# EAGLE design Lepton (EAGLE 6.4)

## Sheet 1 of 5
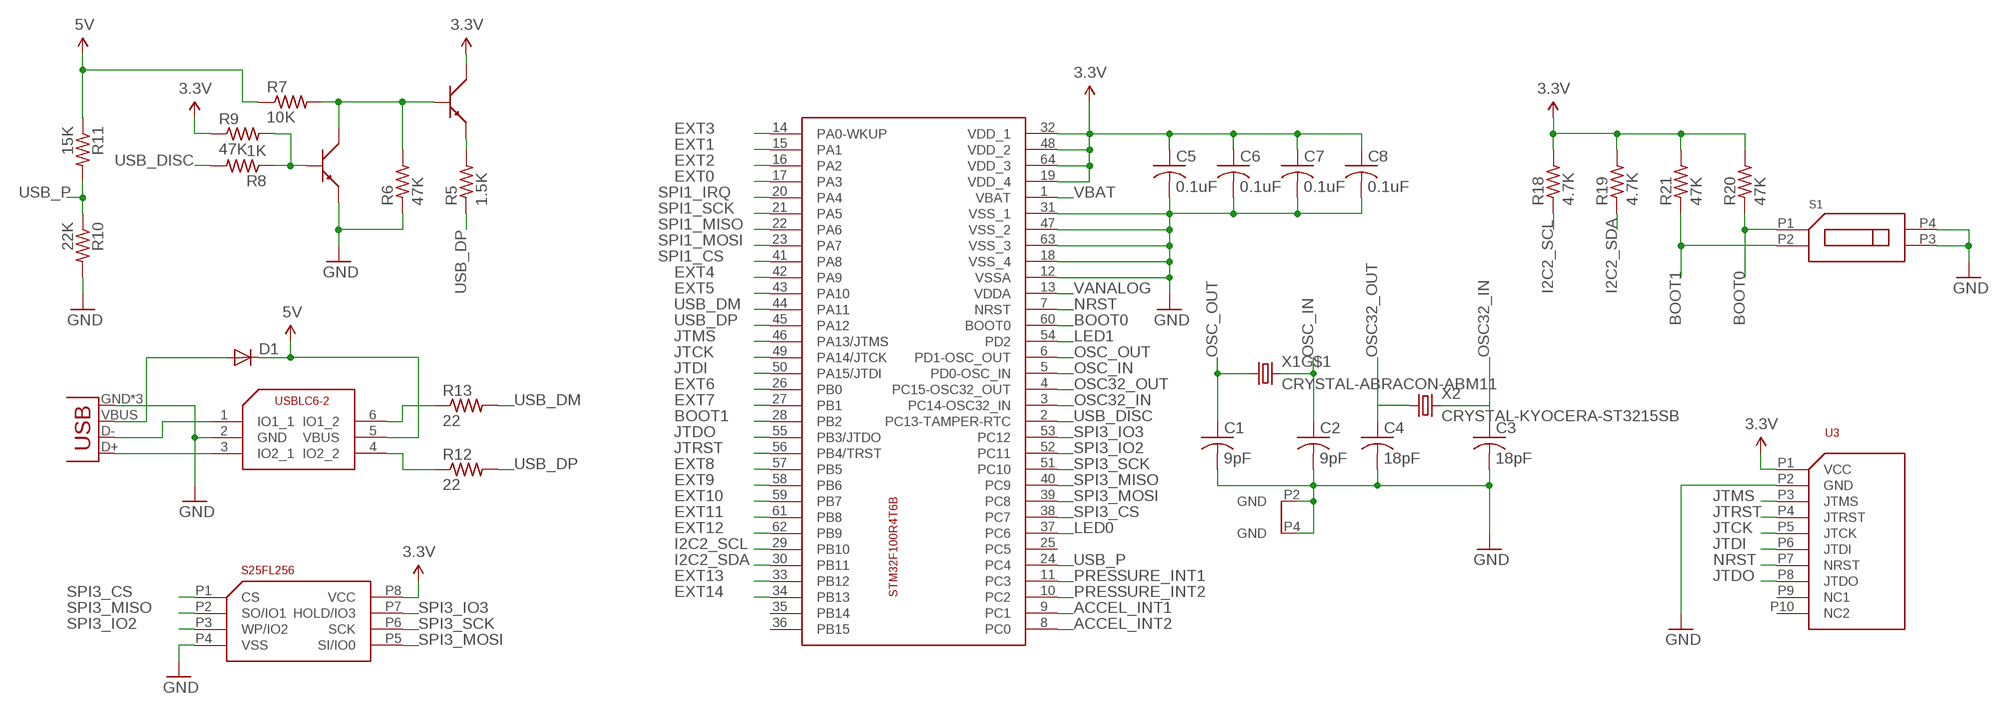
[diagram p0: schematic, sheet 1]

### Parts
C1  9pF  C-USC0201  [C0201]
C2  9pF  C-USC0201  [C0201]
C3  18pF  C-USC0201  [C0201]
C4  18pF  C-USC0201  [C0201]
C5  0.1uF  C-USC0201  [C0201]
C6  0.1uF  C-USC0201  [C0201]
C7  0.1uF  C-USC0201  [C0201]
C8  0.1uF  C-USC0201  [C0201]
D1  DIODE-MINIMELF  [MINIMELF]
JP1  USB-MICROB  [USB-MICROB]
R5  1.5K  R-US_R0402  [R0402]
R6  47K  R-US_R0402  [R0402]
R7  10K  R-US_R0201  [R0201]
R8  1K  R-US_R0201  [R0201]
R9  47K  R-US_R0201  [R0201]
R10  22K  R-US_R0201  [R0201]
R11  15K  R-US_R0201  [R0201]
R12  22  R-US_R0201  [R0201]
R13  22  R-US_R0201  [R0201]
R18  4.7K  R-US_R0201  [R0201]
R19  4.7K  R-US_R0201  [R0201]
R20  47K  R-US_R0201  [R0201]
R21  47K  R-US_R0201  [R0201]
S1  SWITCH-DIP-GDH-02  [SWITCH-DIP-GDH-02]
U2  STM32F100R4T6B  [S-PQFP64-G64]
U3  STM32-JTAG-FFC  [FCI-FFC-10P-51281-1494]
U$1  SPANSION-S25FL256  [SPANSION-WSON-8]
U$2  BIPOLAR-PMBT6428  [DUBLIB_SOT23]
U$3  BIPOLAR-PMBT6428  [DUBLIB_SOT23]
U$4  USBLC6-2  [SOT23-6L]
X1  CRYSTAL-ABRACON-ABM11  [ABM11]
X2  CRYSTAL-KYOCERA-ST3215SB  [CRYSTAL-KYOCERA-ST3215SB]

### Nets
3.3V: C5.1 C6.1 C7.1 C8.1 R9.1 R18.2 R19.2 R20.2 R21.2 U2.19(VDD_4) U2.32(VDD_1) U2.48(VDD_2) U2.64(VDD_3) U3.P1(VCC) U$1.P8(VCC) U$2.3 ; supply symbol labelled @3.3V ; also sheet 3,4,5
5V: D1.C R7.1 R11.1 U$4.5(VBUS) ; supply symbol labelled @5V ; also sheet 2,4
ACCEL_INT1: U2.9(PC1)
ACCEL_INT2: U2.8(PC0) ; also sheet 5
BOOT0: R20.1 S1.P1(SW0_0) U2.60(BOOT0)
BOOT1: R21.1 S1.P2(SW1_0) U2.28(PB2)
EXT0: U2.17(PA3) ; also sheet 2
EXT1: U2.15(PA1) ; also sheet 2
EXT2: U2.16(PA2) ; also sheet 2
EXT3: U2.14(PA0-WKUP) ; also sheet 2
EXT4: U2.42(PA9) ; also sheet 2
EXT5: U2.43(PA10) ; also sheet 2
EXT6: U2.26(PB0) ; also sheet 2
EXT7: U2.27(PB1) ; also sheet 2
EXT8: U2.57(PB5) ; also sheet 2
EXT9: U2.58(PB6) ; also sheet 2
EXT10: U2.59(PB7) ; also sheet 2
EXT11: U2.61(PB8) ; also sheet 2
EXT12: U2.62(PB9) ; also sheet 2
EXT13: U2.33(PB12) ; also sheet 2
EXT14: U2.34(PB13) ; also sheet 2
GND: C1.2 C2.2 C3.2 C4.2 C5.2 C6.2 C7.2 C8.2 JP1.GND JP1.MT1(GND) JP1.MT2(GND) R6.1 R10.2 S1.P3(SW1_1) S1.P4(SW0_1) U2.12(VSSA) U2.18(VSS_4) U2.31(VSS_1) U2.47(VSS_2) U2.63(VSS_3) U3.P2(GND) U$1.P4(VSS) U$3.2 U$4.2(GND) X1.P2(GND) X1.P4(GND) ; supply symbol labelled @GND ; also sheet 2,3,4,5
I2C2_SCL: R18.1 U2.29(PB10) ; also sheet 5
I2C2_SDA: R19.1 U2.30(PB11) ; also sheet 5
JTCK: U2.49(PA14/JTCK) U3.P5(JTCK)
JTDI: U2.50(PA15/JTDI) U3.P6(JTDI)
JTDO: U2.55(PB3/JTDO) U3.P8(JTDO)
JTMS: U2.46(PA13/JTMS) U3.P3(JTMS)
JTRST: U2.56(PB4/TRST) U3.P4(JTRST)
LED0: U2.37(PC6) ; also sheet 2
LED1: U2.54(PD2) ; also sheet 2
N$1: JP1.D+ U$4.3(IO2_1)
N$2: JP1.D- U$4.1(IO1_1)
N$9: D1.A JP1.VBUS
N$14: R13.1 U$4.6(IO1_2)
N$15: R5.2 U$2.2
N$16: R6.2 R7.2 U$2.1 U$3.3
N$17: R8.1 R9.2 U$3.1
N$19: R12.1 U$4.4(IO2_2)
NRST: U2.7(NRST) U3.P7(NRST)
OSC32_IN: C3.1 U2.3(PC14-OSC32_IN) X2.P2
OSC32_OUT: C4.1 U2.4(PC15-OSC32_OUT) X2.P1
OSC_IN: C2.1 U2.5(PD0-OSC_IN) X1.P3
OSC_OUT: C1.1 U2.6(PD1-OSC_OUT) X1.P1
PRESSURE_INT1: U2.11(PC3) ; also sheet 5
PRESSURE_INT2: U2.10(PC2) ; also sheet 5
SPI1_CS: U2.41(PA8) ; also sheet 3
SPI1_IRQ: U2.20(PA4) ; also sheet 3
SPI1_MISO: U2.22(PA6) ; also sheet 3
SPI1_MOSI: U2.23(PA7) ; also sheet 3
SPI1_SCK: U2.21(PA5) ; also sheet 3
SPI3_CS: U2.38(PC7) U$1.P1(CS)
SPI3_IO2: U2.52(PC11) U$1.P3(WP/IO2)
SPI3_IO3: U2.53(PC12) U$1.P7(HOLD/IO3)
SPI3_MISO: U2.40(PC9) U$1.P2(SO/IO1)
SPI3_MOSI: U2.39(PC8) U$1.P5(SI/IO0)
SPI3_SCK: U2.51(PC10) U$1.P6(SCK)
USB_DISC: R8.2 U2.2(PC13-TAMPER-RTC) ; also sheet 2
USB_DM: R13.2 U2.44(PA11) ; also sheet 2
USB_DP: R5.1 R12.2 U2.45(PA12) ; also sheet 2
USB_P: R10.1 R11.2 U2.24(PC4)
VANALOG: U2.13(VDDA) ; also sheet 4
VBAT: U2.1(VBAT) ; also sheet 4
Unconnected: U2.25(PC5) U2.35(PB14) U2.36(PB15) U3.P9(NC1) U3.P10(NC2)

## Sheet 2 of 5
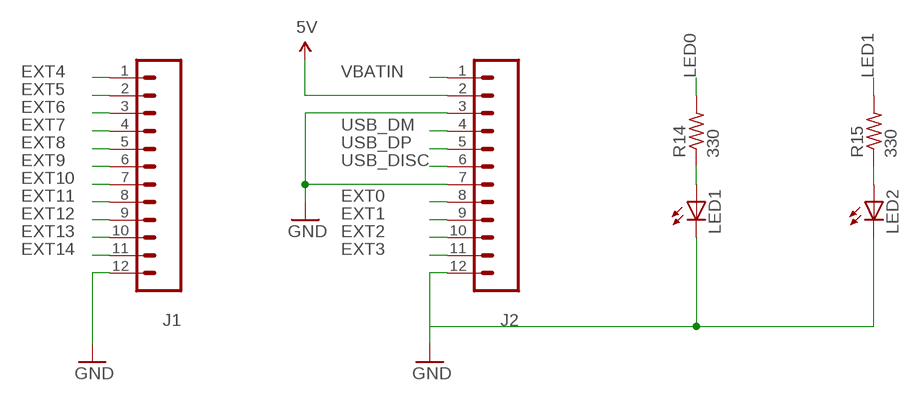
[diagram p1: schematic, sheet 2]

### Parts
J1  M12  [1X12]
J2  M12  [1X12]
LED1  LED0603  [LED-0603]
LED2  LED0603  [LED-0603]
R14  330  R-US_R0201  [R0201]
R15  330  R-US_R0201  [R0201]

### Nets
5V: J2.2 ; supply symbol labelled @5V ; also sheet 1,4
EXT0: J2.8 ; also sheet 1
EXT1: J2.9 ; also sheet 1
EXT2: J2.10 ; also sheet 1
EXT3: J2.11 ; also sheet 1
EXT4: J1.1 ; also sheet 1
EXT5: J1.2 ; also sheet 1
EXT6: J1.3 ; also sheet 1
EXT7: J1.4 ; also sheet 1
EXT8: J1.5 ; also sheet 1
EXT9: J1.6 ; also sheet 1
EXT10: J1.7 ; also sheet 1
EXT11: J1.8 ; also sheet 1
EXT12: J1.9 ; also sheet 1
EXT13: J1.10 ; also sheet 1
EXT14: J1.11 ; also sheet 1
GND: J1.12 J2.3 J2.7 J2.12 LED1.C LED2.C ; supply symbol labelled @GND ; also sheet 1,3,4,5
LED0: R14.2 ; also sheet 1
LED1: R15.2 ; also sheet 1
N$24: LED1.A R14.1
N$27: LED2.A R15.1
USB_DISC: J2.6 ; also sheet 1
USB_DM: J2.4 ; also sheet 1
USB_DP: J2.5 ; also sheet 1
VBATIN: J2.1 ; also sheet 4

## Sheet 3 of 5
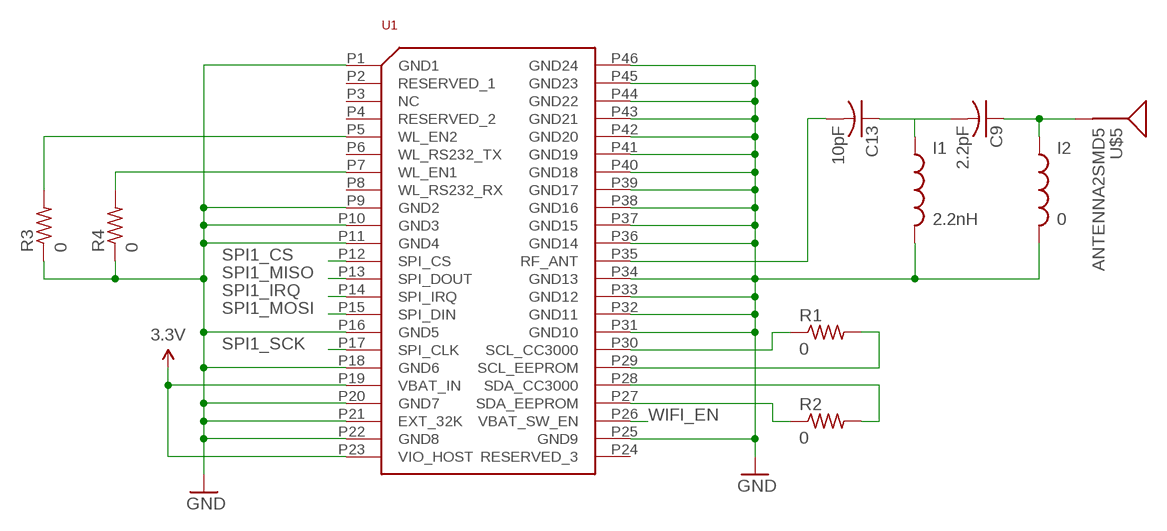
[diagram p2: schematic, sheet 3]

### Parts
C9  2.2pF  C-USC0201  [C0201]
C13  10pF  C-USC0201  [C0201]
I1  2.2nH  INDUCTOR0402  [C0402]
I2  0  INDUCTOR0402  [C0402]
R1  0  R-US_R0201  [R0201]
R2  0  R-US_R0201  [R0201]
R3  0  R-US_R0201  [R0201]
R4  0  R-US_R0201  [R0201]
U1  CC3000  [CC3000]
U$5  ANTENNA2SMD5  [ANTENNA-CHIP5]

### Nets
3.3V: U1.P19(VBAT_IN) U1.P23(VIO_HOST) ; supply symbol labelled @3.3V ; also sheet 1,4,5
ANT: C13.2 U1.P35(RF_ANT)
GND: I1.2 I2.2 R3.1 R4.1 U1.P1(GND1) U1.P9(GND2) U1.P10(GND3) U1.P11(GND4) U1.P16(GND5) U1.P18(GND6) U1.P20(GND7) U1.P21(EXT_32K) U1.P22(GND8) U1.P25(GND9) U1.P31(GND10) U1.P32(GND11) U1.P33(GND12) U1.P34(GND13) U1.P36(GND14) U1.P37(GND15) U1.P38(GND16) U1.P39(GND17) U1.P40(GND18) U1.P41(GND19) U1.P42(GND20) U1.P43(GND21) U1.P44(GND22) U1.P45(GND23) U1.P46(GND24) ; supply symbol labelled @GND ; also sheet 1,2,4,5
N$3: C9.2 C13.1 I1.1
N$10: R3.2 U1.P5(WL_EN2)
N$21: R4.2 U1.P7(WL_EN1)
N$22: C9.1 I2.1 U$5.FEED(SIGNAL)
N$23: R1.1 U1.P30(SCL_CC3000)
N$47: R1.2 U1.P29(SCL_EEPROM)
N$50: R2.2 U1.P28(SDA_CC3000)
N$51: R2.1 U1.P27(SDA_EEPROM)
SPI1_CS: U1.P12(SPI_CS) ; also sheet 1
SPI1_IRQ: U1.P14(SPI_IRQ) ; also sheet 1
SPI1_MISO: U1.P13(SPI_DOUT) ; also sheet 1
SPI1_MOSI: U1.P15(SPI_DIN) ; also sheet 1
SPI1_SCK: U1.P17(SPI_CLK) ; also sheet 1
WIFI_EN: U1.P26(VBAT_SW_EN)
Unconnected: U1.P2(RESERVED_1) U1.P3(NC) U1.P4(RESERVED_2) U1.P6(WL_RS232_TX) U1.P8(WL_RS232_RX) U1.P24(RESERVED_3)

## Sheet 4 of 5
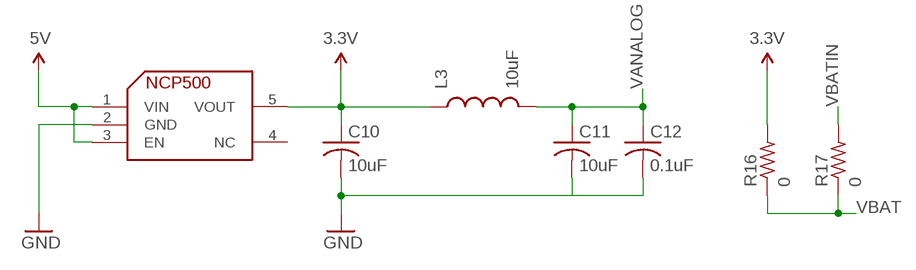
[diagram p3: schematic, sheet 4]

### Parts
C10  10uF  C-USC0603  [C0603]
C11  10uF  C-USC0603  [C0603]
C12  0.1uF  C-USC0201  [C0201]
L3  10uF  INDUCTOR0603  [0603]
R16  0  R-US_R0402  [R0402]
R17  0  R-US_R0402  [R0402]
U$7  NCP500  [SOT23-5L]

### Nets
3.3V: C10.1 L3.1 R16.2 U$7.5(VOUT) ; supply symbol labelled @3.3V ; also sheet 1,3,5
5V: U$7.1(VIN) U$7.3(EN) ; supply symbol labelled @5V ; also sheet 1,2
GND: C10.2 C11.2 C12.2 U$7.2(GND) ; supply symbol labelled @GND ; also sheet 1,2,3,5
VANALOG: C11.1 C12.1 L3.2 ; also sheet 1
VBAT: R16.1 R17.1 ; also sheet 1
VBATIN: R17.2 ; also sheet 2
Unconnected: U$7.4(NC)

## Sheet 5 of 5
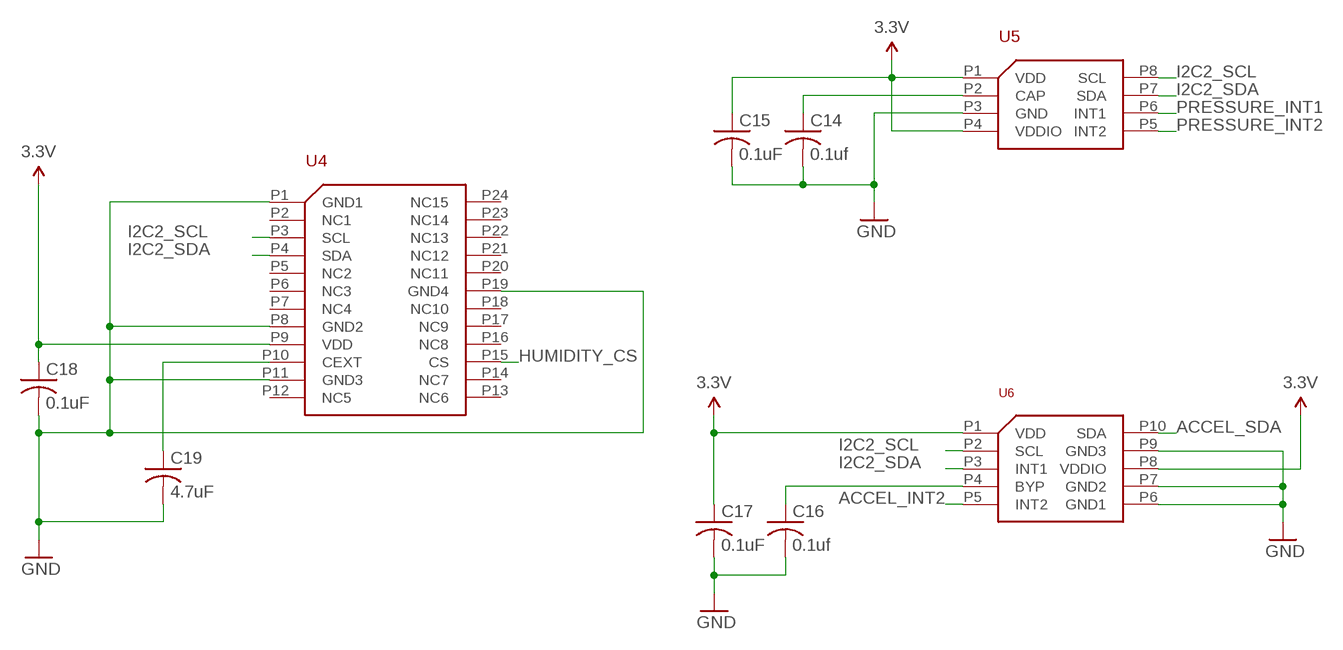
[diagram p4: schematic, sheet 5]

### Parts
C14  0.1uf  C-USC0201  [C0201]
C15  0.1uF  C-USC0201  [C0201]
C16  0.1uf  C-USC0201  [C0201]
C17  0.1uF  C-USC0201  [C0201]
C18  0.1uF  C-USC0201  [C0201]
C19  4.7uF  C-USC0402  [C0402]
U4  SILICONLABS-HUMIDITY-SI7005  [SILICONLABS-TQFN-24]
U5  FREESCALE-PRESSURE-MPL3115A2  [UQFN-8L]
U6  MMA8653FC  [DFN-2X2-10]

### Nets
3.3V: C15.1 C17.1 C18.1 U4.P9(VDD) U5.P1(VDD) U5.P4(VDDIO) U6.P1(VDD) U6.P8(VDDIO) ; supply symbol labelled @3.3V ; also sheet 1,3,4
ACCEL_INT2: U6.P5(INT2) ; also sheet 1
ACCEL_SDA: U6.P10(SDA)
GND: C14.2 C15.2 C16.2 C17.2 C18.2 C19.2 U4.P1(GND1) U4.P8(GND2) U4.P11(GND3) U4.P19(GND4) U5.P3(GND) U6.P6(GND1) U6.P7(GND2) U6.P9(GND3) ; supply symbol labelled @GND ; also sheet 1,2,3,4
HUMIDITY_CS: U4.P15(CS)
I2C2_SCL: U4.P3(SCL) U5.P8(SCL) U6.P2(SCL) ; also sheet 1
I2C2_SDA: U4.P4(SDA) U5.P7(SDA) U6.P3(INT1) ; also sheet 1
N$4: C16.1 U6.P4(BYP)
N$11: C19.1 U4.P10(CEXT)
N$12: C14.1 U5.P2(CAP)
PRESSURE_INT1: U5.P6(INT1) ; also sheet 1
PRESSURE_INT2: U5.P5(INT2) ; also sheet 1
Unconnected: U4.P2(NC1) U4.P5(NC2) U4.P6(NC3) U4.P7(NC4) U4.P12(NC5) U4.P13(NC6) U4.P14(NC7) U4.P16(NC8) U4.P17(NC9) U4.P18(NC10) U4.P20(NC11) U4.P21(NC12) U4.P22(NC13) U4.P23(NC14) U4.P24(NC15)

## Library data of the parts
C1-C19 = rcl:C-US: CAPACITOR, American symbol
D1 = diode:DIODE-: DIODE
I1 I2 L3 = Pygmy:INDUCTOR: Inductors Basic Inductor/Choke - 0603 and 1206. Footprints are not proven and vary greatly between part numbers.
J1 J2 = Pygmy:M12
JP1 = SparkFun-Connectors:USB: USB Connectors USB-B-PTH is fully proven SKU : PRT-00139/CONN-08278 USB-miniB is fully proven SKU : PRT-00587 USB-A-PCB is untested. USB-A-H is throughly reviewed, but untested. Spark Fun Electronics SKU : PRT-00437 USB-B-SMT is throughly reviewed, but untested. Needs silkscreen touching up. USB-A-S has not been used/tested USB-MB-H has not been used/tested USB-MICROB has been used. CONN-09505; PROD_ID: CONN-09505
LED1 LED2 = Pygmy:LED: LEDs Standard schematic elements and footprints for 5mm, 3mm, 1206, and 0603 sized LEDs. 5mm - Spark Fun Electronics SKU : COM-00529 (and others)
R1-R21 = rcl:R-US_: RESISTOR, American symbol
S1 = Pygmy:SWITCH-DIP-GDH-02
U1 = Pygmy:CC3000
U2 = Pygmy:STM32F100R4T6B
U3 = Pygmy:STM32-JTAG-FFC
U4 = Pygmy:SILICONLABS-HUMIDITY-SI7005
U5 = Pygmy:FREESCALE-PRESSURE-MPL3115A2
U6 = Pygmy:MMA8653FC
U$1 = Pygmy:SPANSION-S25FL256
U$2 U$3 = Pygmy:BIPOLAR-PMBT6428
U$4 = Pygmy:USBLC6-2
U$5 = Pygmy:ANTENNA2: Antenna Single endded antenna. Common with smaller chip antennas. CHIP4 package is the GPS Chip Antenna SKU: GPS-08418. CHIP5 package is 2.4GHz chip antenna SKU: WRL-00144.
U$7 = Pygmy:NCP500
X1 = Pygmy:CRYSTAL-ABRACON-ABM11
X2 = Pygmy:CRYSTAL-KYOCERA-ST3215SB

## Board
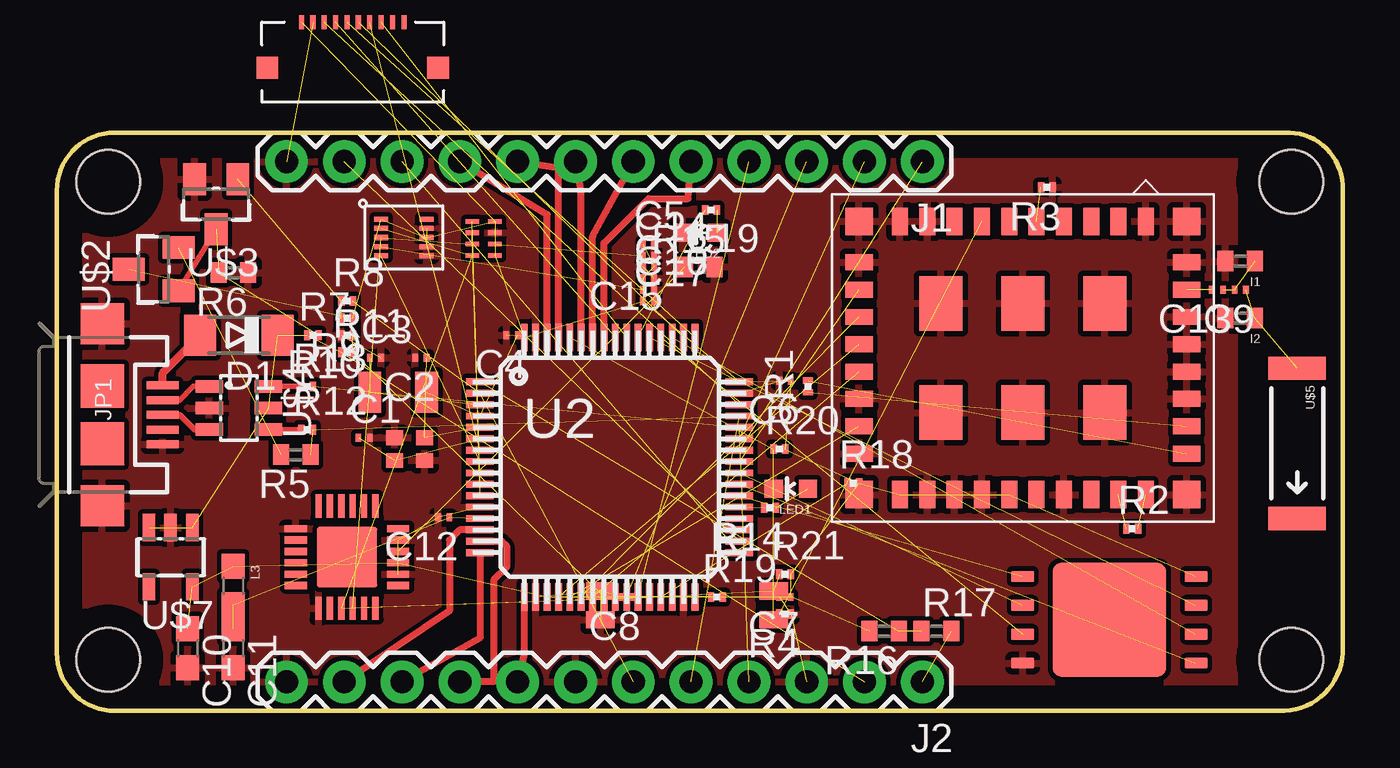
[diagram p5: board, top side]
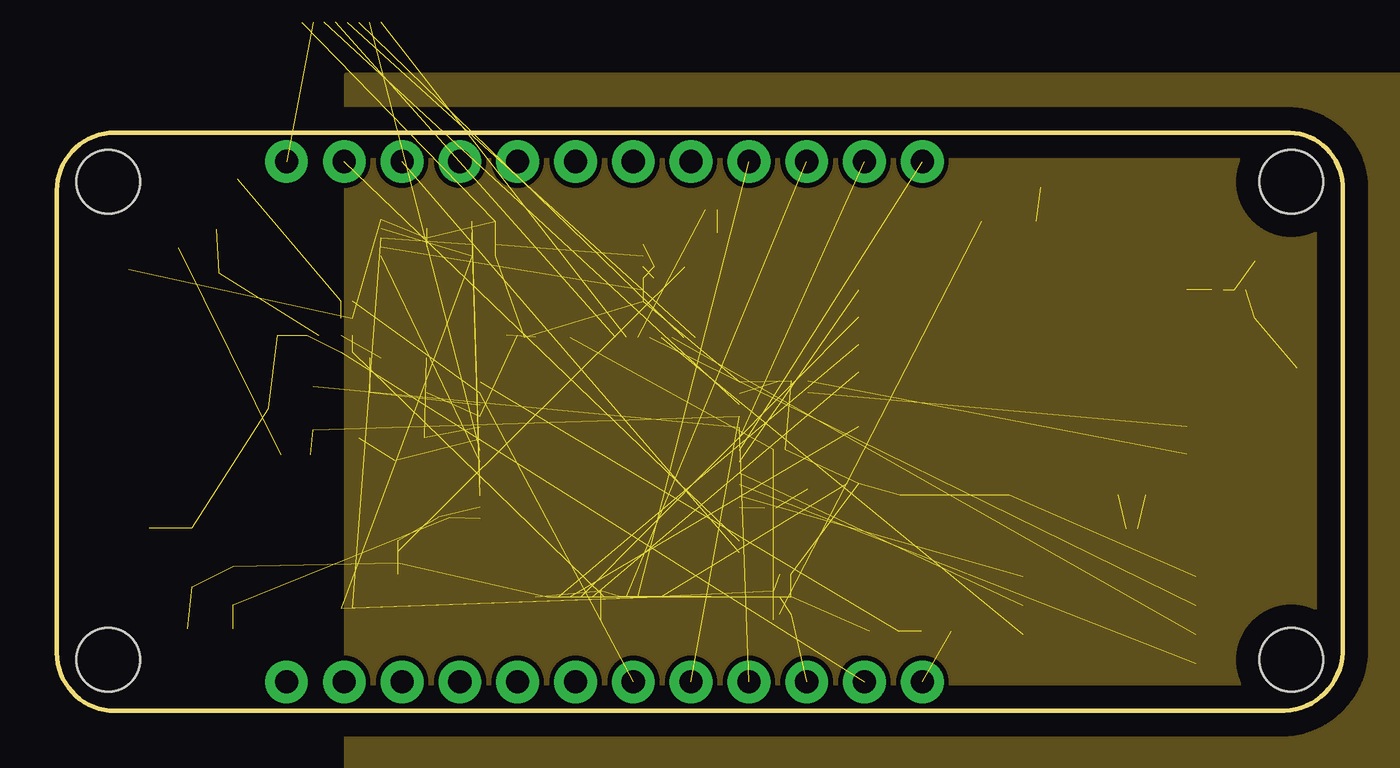
[diagram p6: board, inner layer Route2]
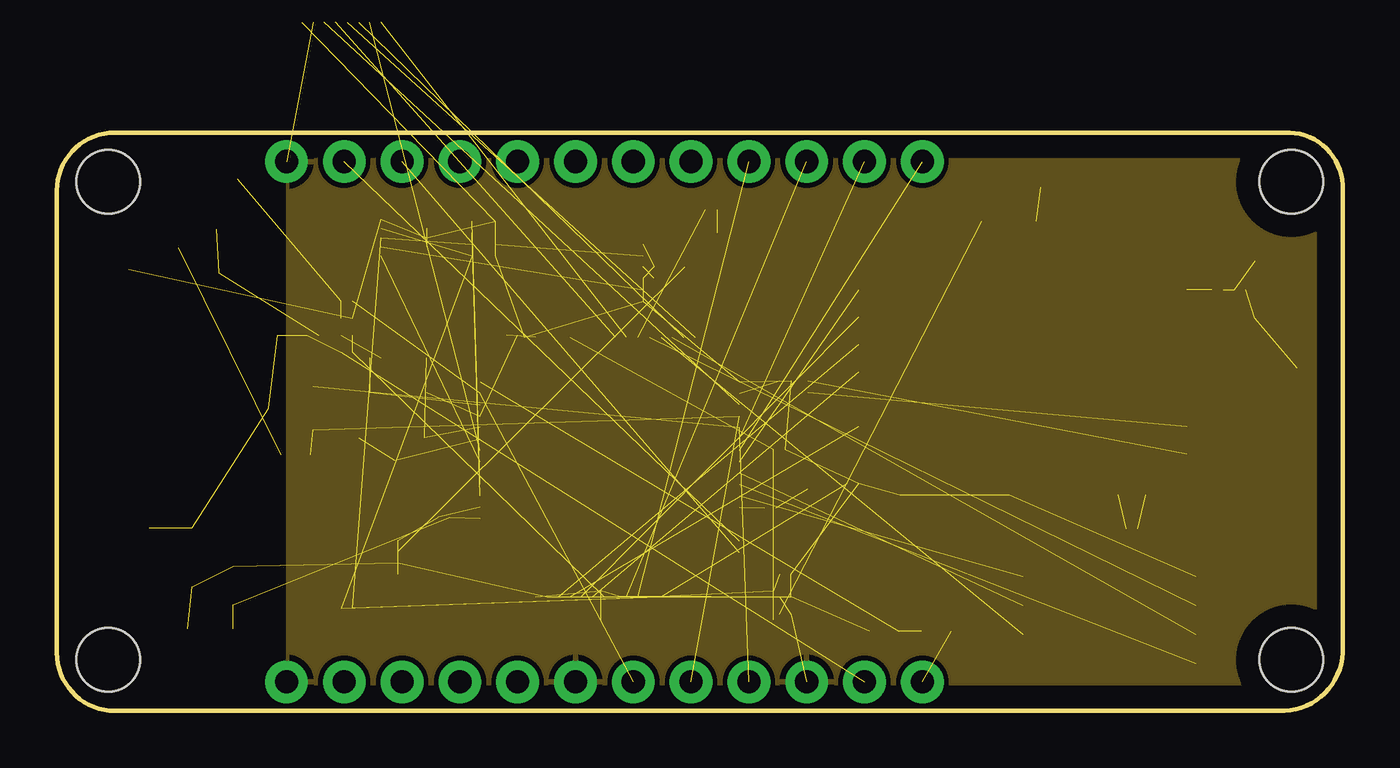
[diagram p7: board, inner layer Route3]
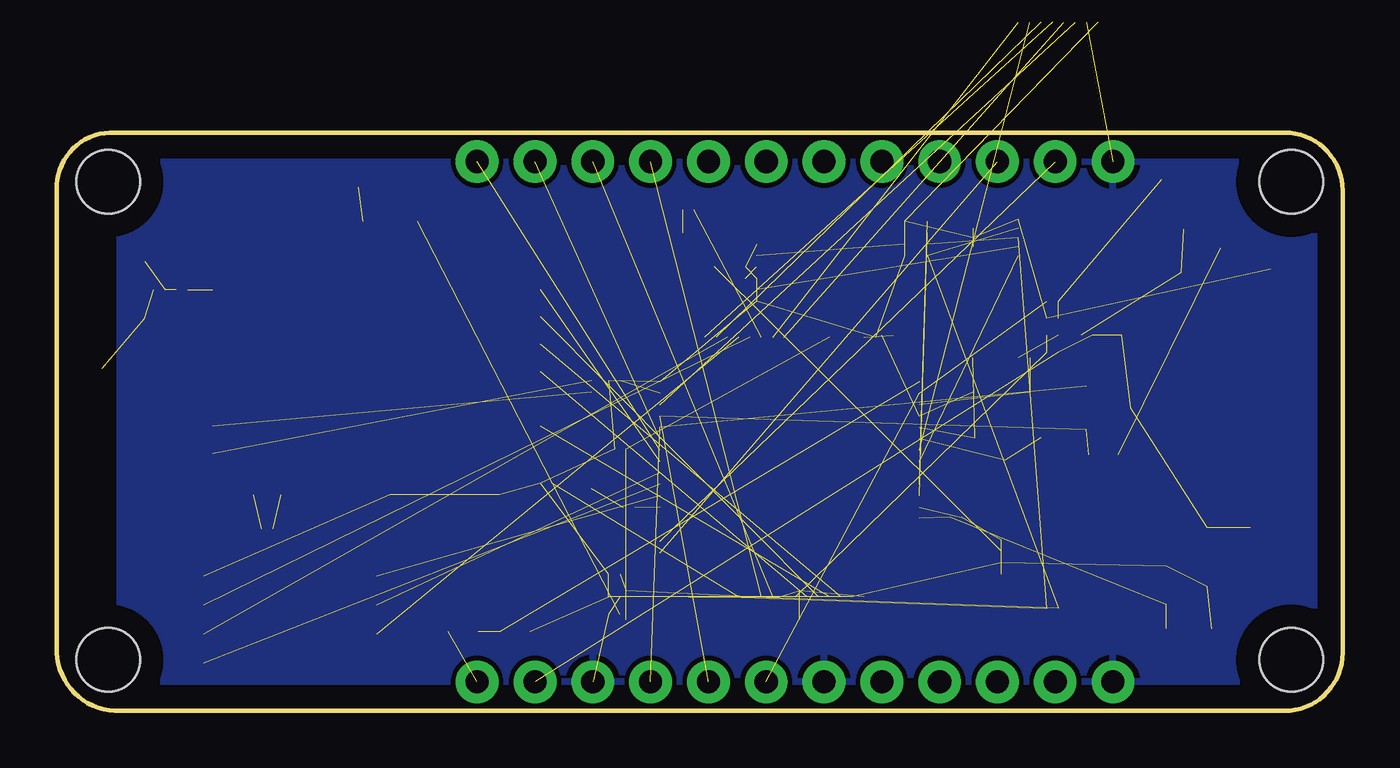
[diagram p8: board, bottom side, seen from below]

Size 56.5 x 25.4 mm. Coordinates in mm from the lower left corner, seen from the top.
Outline: 0,22.86 0,2.54 arc90 2.54,0 53.96,0 arc90 56.5,2.79 56.5,23.11 arc90 53.96,25.4 2.54,25.4 arc90 0,22.86
Copper layers (1*2*3*16): Top 0.035mm / dielectric 1.5mm / Route2 0.035mm / dielectric 0.15mm / Route3 0.035mm / dielectric 0.2mm / Bottom 0.035mm
Design rules "default *": minimum track width 10mil, minimum drill 24mil, track to track 8mil, track to pad 8mil, pad to pad 8mil, via to via 8mil, smd to smd 8mil, copper to edge 40mil, drill to drill 8mil, minimum pad ring 10mil, minimum via ring 8mil, stop-mask expansion 4mil, vias tented up to drill 0mil, thermal gap 10mil
Holes 2.8 mm at 2.25,23.25 2.25,2.25 54.25,23.25 54.25,2.25

### Footprints (pad centres in the part's own frame; a part is rotated, then mirrored left to right if it is on the bottom)
C0201 = smd 0.25 x 0.35: 1 -0.25,0; 2 0.25,0
C0603 = smd 1.1 x 1: 1 -0.85,0; 2 0.85,0
C0402 = smd 0.7 x 0.9: 1 -0.65,0; 2 0.65,0
MINIMELF = smd 1.4 x 1.8: A 1.7,0; C -1.7,0
1X12 = drill 1.016 pad 1.88: 1 -16.51,0; 2 -13.97,0; 3 -11.43,0; 4 -8.89,0; 5 -6.35,0; 6 -3.81,0; 7 -1.27,0; 8 1.27,0; 9 3.81,0; 10 6.35,0; 11 8.89,0; 12 11.43,0
USB-MICROB = smd 0.35 x 1.4: D+ 0,2.65; D- -0.65,2.65; GND 1.3,2.65; ID 0.65,2.65; VBUS -1.3,2.65 | smd 1.8 x 1.9: MT1 -4,0; MT2 4,0 | smd 1.9 x 1.9: P$1 -1.27,0; P$2 1.27,0
0603 = smd 1.1 x 1: 1 -0.85,0; 2 0.85,0
LED-0603 = smd 0.8 x 0.8: A 0,-0.75; C 0,0.75
R0201 = smd 0.28 x 0.43: 1 -0.255,0; 2 0.255,0
R0402 = smd 0.7 x 0.9: 1 -0.65,0; 2 0.65,0
SWITCH-DIP-GDH-02 = smd 0.762 x 1.27: P1 0,0; P2 1.27,0; P3 1.27,7.62; P4 0,7.62
CC3000 = smd 1.2 x 0.7: P1 0,12.6; P2 0,11.4; P3 0,10.2; P4 0,9; P5 0,7.8; P6 0,6.6; P7 0,5.4; P8 0,4.2; P9 0,3; P10 0,1.8; P19 12,1.8; P20 12,3; P21 12,4.2; P22 12,5.4; P23 12,6.6; P24 12,7.8; P25 12,9; P26 12,10.2; P27 12,11.4; P28 12,12.6 | smd 0.7 x 1.2: P11 1.8,0; P12 3,0; P13 4.2,0; P14 5.4,0; P15 6.6,0; P16 7.8,0; P17 9,0; P18 10.2,0; P29 10.2,14.4; P30 9,14.4; P31 7.8,14.4; P32 6.6,14.4; P33 5.4,14.4; P34 4.2,14.4; P35 3,14.4; P36 1.8,14.4 | smd 2.4 x 1.9: P37 3.6,10.8; P38 3.6,7.2; P39 3.6,3.6; P40 8.4,10.8; P41 8.4,7.2; P42 8.4,3.6 | smd 1.2 x 1.2: P43 0,14.4; P44 0,0; P45 12,0; P46 12,14.4
S-PQFP64-G64 = smd 1.2 x 0.3: 1 -5.7,3.75; 2 -5.7,3.25; 3 -5.7,2.75; 4 -5.7,2.25; 5 -5.7,1.75; 6 -5.7,1.25; 7 -5.7,0.75; 8 -5.7,0.25; 9 -5.7,-0.25; 10 -5.7,-0.75; 11 -5.7,-1.25; 12 -5.7,-1.75; 13 -5.7,-2.25; 14 -5.7,-2.75; 15 -5.7,-3.25; 16 -5.7,-3.75; 33 5.7,-3.75; 34 5.7,-3.25; 35 5.7,-2.75; 36 5.7,-2.25; 37 5.7,-1.75; 38 5.7,-1.25; 39 5.7,-0.75; 40 5.7,-0.25; 41 5.7,0.25; 42 5.7,0.75; 43 5.7,1.25; 44 5.7,1.75; 45 5.7,2.25; 46 5.7,2.75; 47 5.7,3.25; 48 5.7,3.75 | smd 0.3 x 1.2: 17 -3.75,-5.7; 18 -3.25,-5.7; 19 -2.75,-5.7; 20 -2.25,-5.7; 21 -1.75,-5.7; 22 -1.25,-5.7; 23 -0.75,-5.7; 24 -0.25,-5.7; 25 0.25,-5.7; 26 0.75,-5.7; 27 1.25,-5.7; 28 1.75,-5.7; 29 2.25,-5.7; 30 2.75,-5.7; 31 3.25,-5.7; 32 3.75,-5.7; 49 3.75,5.7; 50 3.25,5.7; 51 2.75,5.7; 52 2.25,5.7; 53 1.75,5.7; 54 1.25,5.7; 55 0.75,5.7; 56 0.25,5.7; 57 -0.25,5.7; 58 -0.75,5.7; 59 -1.25,5.7; 60 -1.75,5.7; 61 -2.25,5.7; 62 -2.75,5.7; 63 -3.25,5.7; 64 -3.75,5.7
FCI-FFC-10P-51281-1494 = smd 0.95 x 0.95: GND1 -3.75,-2; GND2 3.75,-2 | smd 0.225 x 0.6: P1 -2.25,0; P2 -1.75,0; P3 -1.25,0; P4 -0.75,0; P5 -0.25,0; P6 0.25,0; P7 0.75,0; P8 1.25,0; P9 1.75,0; P10 2.25,0
SILICONLABS-TQFN-24 = smd 0.3 x 1: P1 -1.25,-2.25; P2 -0.75,-2.25; P3 -0.25,-2.25; P4 0.25,-2.25; P5 0.75,-2.25; P6 1.25,-2.25; P13 1.25,2.25; P14 0.75,2.25; P15 0.25,2.25; P16 -0.25,2.25; P17 -0.75,2.25; P18 -1.25,2.25 | smd 1 x 0.3: P7 2.25,-1.25; P8 2.25,-0.75; P9 2.25,-0.25; P10 2.25,0.25; P11 2.25,0.75; P12 2.25,1.25; P19 -2.25,1.25; P20 -2.25,0.75; P21 -2.25,0.25; P22 -2.25,-0.25; P23 -2.25,-0.75; P24 -2.25,-1.25 | smd 2.65 x 2.65: THERMAL 0,0
UQFN-8L = smd 0.2 x 0.6: P1 0,0; P2 0.5,0; P3 1,0; P4 1.5,0; P5 1.5,1; P6 1,1; P7 0.5,1; P8 0,1
DFN-2X2-10 = smd 0.6 x 0.225: P1 0,0; P2 0,-0.4; P3 0,-0.8; P4 0,-1.2; P5 0,-1.6; P6 2,-1.6; P7 2,-1.2; P8 2,-0.8; P9 2,-0.4; P10 2,0
SPANSION-WSON-8 = smd 0.5 x 1: P1 -1.905,-3.81; P2 -0.635,-3.81; P3 0.635,-3.81; P4 1.905,-3.81; P5 1.905,3.81; P6 0.635,3.81; P7 -0.635,3.81; P8 -1.905,3.81 | smd 5 x 5: P$9 0,0
DUBLIB_SOT23 = smd 1 x 1.4: 1 -0.95,-1.1; 2 0.95,-1.1; 3 0,1.1
SOT23-6L = smd 0.55 x 1.2: 1 -0.95,-1.3; 2 0,-1.3; 3 0.95,-1.3; 4 0.95,1.3; 5 0,1.3; 6 -0.95,1.3
ANTENNA-CHIP5 = smd 1.016 x 2.54: FEED -3.302,0; NC 3.302,0
SOT23-5L = smd 0.55 x 1.2: 1 -0.95,-1.3; 2 0,-1.3; 3 0.95,-1.3; 4 0.95,1.3; 5 -0.95,1.3
ABM11 = smd 0.75 x 0.65: P1 -0.65,-0.5; P2 0.65,-0.5; P3 0.65,0.5; P4 -0.65,0.5
CRYSTAL-KYOCERA-ST3215SB = smd 1 x 1.8: P1 -1.25,0; P2 1.25,0

### Placement (x,y rotation side)
C1  13.5,12 0 top
C2  16,15.5 180 top
C3  14,15.5 0 top
C4  20,16.5 180 top
C5  26,20.5 0 top
C6  32,14.5 180 top
C7  32,5 180 top
C8  25,5 180 top
C9  52,18.5 180 top
C10  5.75,2.75 270 top
C11  7.75,2.75 270 top
C12  17,8.5 180 top
C13  51,18.5 180 top
C14  26,20 0 top
C15  26,19.5 180 top
C16  26,18.5 0 top
C17  26,18 0 top
C18  26,19 0 top
C19  28.25,19.5 0 top
D1  8,16.5 180 top
I1  52,19.75 180 top
I2  52,17.25 180 top
J1  21.52,24.13 180 top
J2  21.52,1.27 180 top
JP1  2,13 270 top
L3  7.75,5.5 270 top
LED1  32.25,9.75 90 top
LED2  28.25,21 90 top
R1  33,14.25 90 top
R2  47.25,8 0 top
R3  43.5,23 180 top
R4  32,4.25 180 top
R5  10.5,11.25 180 top
R6  7.75,19.25 180 top
R7  11.25,16.5 0 top
R8  12.75,18 0 top
R9  12.75,17.25 180 top
R10  12.75,16.5 180 top
R11  12.75,15.75 0 top
R12  11,12.35 0 top
R13  11,14.25 0 top
R14  31.34,8.92 180 top
R15  28.75,22 180 top
R16  36.35,3.5 180 top
R17  38.65,3.5 0 top
R18  35,10 0 top
R19  29,5 0 top
R20  31.75,11.5 0 top
R21  32,6 0 top
S1  31.5,4 90 top
U1  35.25,21.5 270 top
U2  24.29,10.7 0 top
U3  13,30.25 0 top
U4  12.75,6.75 0 top
U5  19.25,20 90 top
U6  14.25,21.59 0 top
U$1  46.25,4 270 top
U$2  4.25,19.4 90 top
U$3  7,22.25 180 top
U$4  8,13.3 270 top
U$5  54.5,11.75 270 top
U$7  5,6.75 180 top
X1  15.5,11.5 0 top
X2  15,14 180 top

### Tracks (layer width: path | path; a pad name or v marks a point on that pad's centre or on a via)
3.3V  (29 unrouted)
  pour Route2: 12.7,27.94 59.69,27.94 59.69,-2.54 12.7,-2.54
5V  (6 unrouted)
ACCEL_INT2  (1 unrouted)
ANT  (1 unrouted)
BOOT0  (2 unrouted)
BOOT1  (2 unrouted)
EXT0
  Top 0.3: U2.17 20.54,2.48 J2.8
EXT1
  Top 0.3: U2.15 19.55,7.45 19.75,7.25 19.75,6.3 19.2,5.75 19.2,1.28 J2.9
EXT2
  Top 0.3: U2.16 18.59,3.19 J2.10
EXT3
  Top 0.3: U2.14 17.7,7.95 17.25,7.5 17.25,4.39 J2.11
EXT4  (1 unrouted)
EXT5  (1 unrouted)
EXT6  (1 unrouted)
EXT7  (1 unrouted)
EXT8
  Top 0.3: U2.57 24.04,20.54 26,22.5 27.74,22.5 J1.5
EXT9
  Top 0.3: U2.58 23.54,20.84 J1.6
EXT10
  Top 0.3: U2.59 23.04,22.88 J1.7
EXT11
  Top 0.3: U2.61 22.04,23.84 J1.8
EXT12
  Top 0.3: U2.62 21.54,21.8 J1.9
EXT13  (1 unrouted)
EXT14  (1 unrouted)
GND  (15 unrouted)
  pour Route3: 11.43,30.48 62.23,30.48 62.23,-5.08 10.16,-5.08 10.16,30.48
  pour Top: -1.5,27 51.75,27 51.75,-2.5 -1.5,-2.5
  pour Bottom: -3.25,-4 -3.25,28.5 53.75,28.5 53.75,-4.5 -3.25,-4.5 -3.25,-4
I2C2_SCL  (4 unrouted)
I2C2_SDA  (4 unrouted)
JTCK  (1 unrouted)
JTDI  (1 unrouted)
JTDO  (1 unrouted)
JTMS  (1 unrouted)
JTRST  (1 unrouted)
LED0  (1 unrouted)
LED1  (1 unrouted)
N$1
  Top 0.25: JP1.D+ 5.4,13 6.05,12.35 U$4.3
N$2
  Top 0.25: JP1.D- 5.4,13.65 6,14.25 U$4.1
N$3  (2 unrouted)
N$4  (1 unrouted)
N$9
  Top 0.35: JP1.VBUS 4.65,14.85 D1.A
N$10  (1 unrouted)
N$11  (1 unrouted)
N$12  (1 unrouted)
N$14
  Top 0.25: U$4.6 R13.1
N$15  (1 unrouted)
N$16  (2 unrouted)
  Top 0.25: U$2.1 U$3.3
N$17  (2 unrouted)
N$19
  Top 0.25: U$4.4 R12.1
N$21  (1 unrouted)
N$22  (2 unrouted)
N$23  (1 unrouted)
N$24  (1 unrouted)
N$27  (1 unrouted)
N$47  (1 unrouted)
N$50  (1 unrouted)
N$51  (1 unrouted)
NRST  (1 unrouted)
OSC32_IN  (2 unrouted)
OSC32_OUT  (2 unrouted)
OSC_IN  (2 unrouted)
OSC_OUT  (2 unrouted)
PRESSURE_INT1  (1 unrouted)
PRESSURE_INT2  (1 unrouted)
SPI1_CS  (1 unrouted)
SPI1_IRQ  (1 unrouted)
SPI1_MISO  (1 unrouted)
SPI1_MOSI  (1 unrouted)
SPI1_SCK  (1 unrouted)
SPI3_CS  (1 unrouted)
SPI3_IO2  (1 unrouted)
SPI3_IO3  (1 unrouted)
SPI3_MISO  (1 unrouted)
SPI3_MOSI  (1 unrouted)
SPI3_SCK  (1 unrouted)
USB_DISC  (2 unrouted)
USB_DM  (2 unrouted)
USB_DP  (3 unrouted)
USB_P  (2 unrouted)
VANALOG  (3 unrouted)
VBAT  (2 unrouted)
VBATIN  (1 unrouted)